# EAGLE design 5channel-LED-Relay (EAGLE 9.0.1)
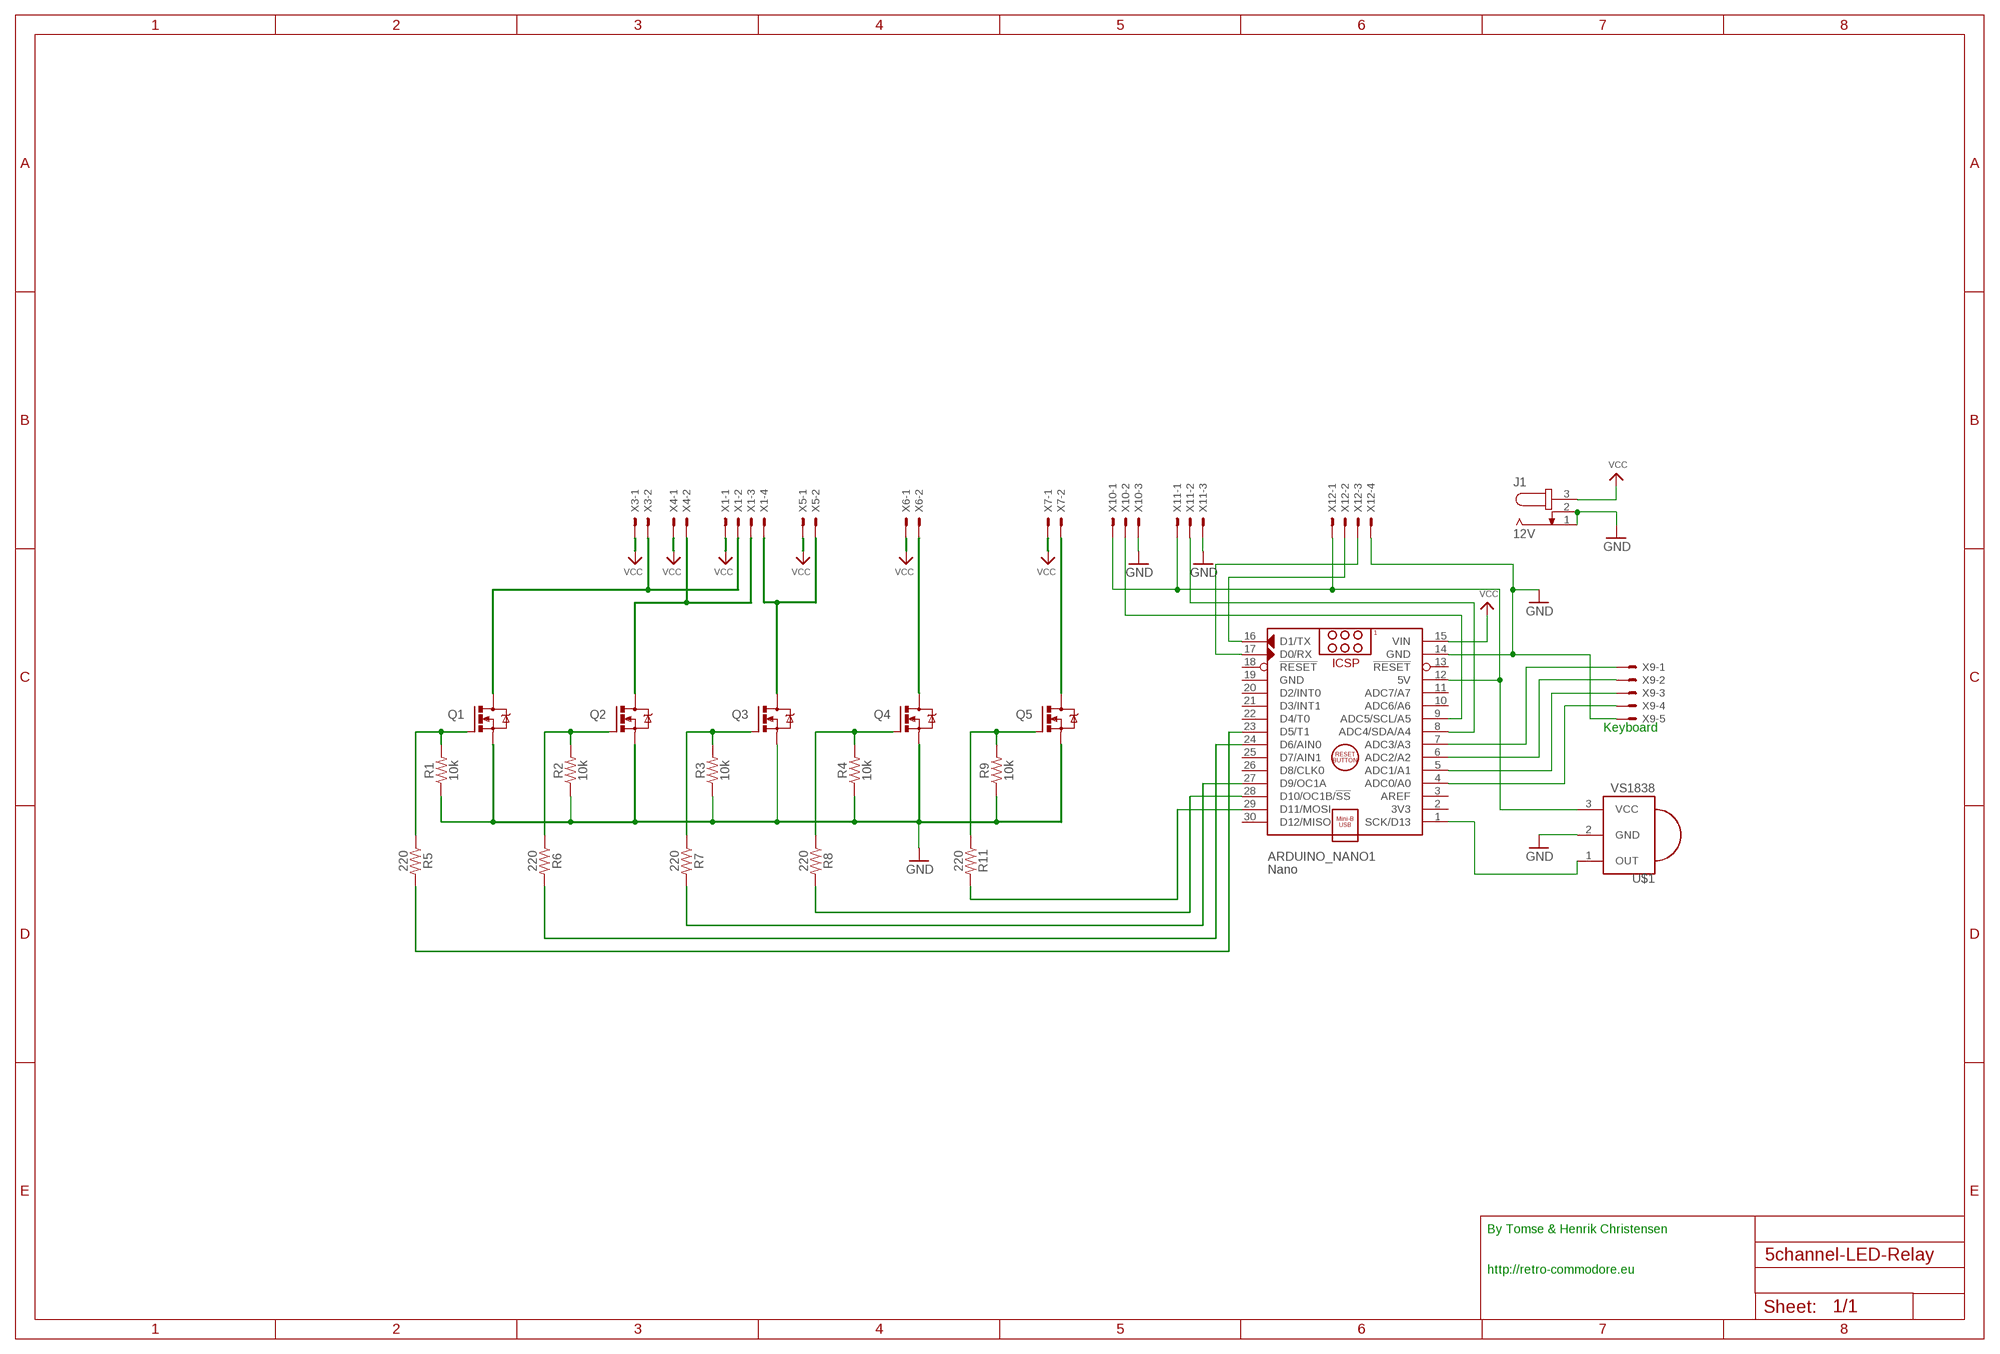
[diagram p0: schematic, sheet 1]

## Parts
ARDUINO_NANO1  Nano  ARDUINO_NANO  [ARDUINO_NANO]
J1  12V  JACK-PLUG0  [SPC4077]
Q1  FQP30N06L  IRF520  [TO220BV]
Q2  FQP30N06L  IRF520  [TO220BV]
Q3  FQP30N06L  IRF520  [TO220BV]
Q4  FQP30N06L  IRF520  [TO220BV]
Q5  FQP30N06L  IRF520  [TO220BV]
R1  10k  10KOHM-HORIZ-1/4W-5%  [AXIAL-0.3]
R2  10k  10KOHM-HORIZ-1/4W-5%  [AXIAL-0.3]
R3  10k  10KOHM-HORIZ-1/4W-5%  [AXIAL-0.3]
R4  10k  10KOHM-HORIZ-1/4W-5%  [AXIAL-0.3]
R5  220  100KOHM-HORIZ-1/4W-5%  [AXIAL-0.3]
R6  220  100KOHM-HORIZ-1/4W-5%  [AXIAL-0.3]
R7  220  100KOHM-HORIZ-1/4W-5%  [AXIAL-0.3]
R8  220  100KOHM-HORIZ-1/4W-5%  [AXIAL-0.3]
R9  10k  10KOHM-HORIZ-1/4W-5%  [AXIAL-0.3]
R11  220  100KOHM-HORIZ-1/4W-5%  [AXIAL-0.3]
U$1  VS1838  PNA460XM  [PNA460XM]
X1  JST-XH-04-PIN-LONG-PAD  [JST-XH-04-PACKAGE-LONG-PAD]
X3  JST-XH-02-PIN-LONG-PAD  [JST-XH-02-PACKAGE-LONG-PAD]
X4  JST-XH-02-PIN-LONG-PAD  [JST-XH-02-PACKAGE-LONG-PAD]
X5  JST-XH-02-PIN-LONG-PAD  [JST-XH-02-PACKAGE-LONG-PAD]
X6  JST-XH-02-PIN-LONG-PAD  [JST-XH-02-PACKAGE-LONG-PAD]
X7  JST-XH-02-PIN-LONG-PAD  [JST-XH-02-PACKAGE-LONG-PAD]
X9  JST-XH-05-PIN-LONG-PAD  [JST-XH-05-PACKAGE-LONG-PAD]
X10  JST-XH-03-PIN-LONG-PAD  [JST-XH-03-PACKAGE-LONG-PAD]
X11  JST-XH-03-PIN-LONG-PAD  [JST-XH-03-PACKAGE-LONG-PAD]
X12  JST-XH-04-PIN-LONG-PAD  [JST-XH-04-PACKAGE-LONG-PAD]

## Nets
5V: ARDUINO_NANO1.12(5V) U$1.3(VCC) X10.1 X11.1 X12.1
C01: Q1.D X1.2 X3.2
C02: Q2.D X1.3 X4.2
C03: Q3.D X1.4 X5.2
C04: Q4.D X6.2
C05: Q5.D X7.2
GND: ARDUINO_NANO1.14(GND) J1.1 J1.2 Q1.S Q2.S Q3.S Q4.S Q5.S R1.P$1 R2.P$1 R3.P$1 R4.P$1 R9.P$1 U$1.2(GND) X9.5 X10.3 X11.3 X12.4
N$1: ARDUINO_NANO1.8(ADC4/SDA/A4) X11.2
N$2: ARDUINO_NANO1.9(ADC5/SCL/A5) X10.2
N$3: ARDUINO_NANO1.29(D11/MOSI) R11.P$2
N$4: ARDUINO_NANO1.1(SCK/D13) U$1.1(OUT)
N$6: Q4.G R4.P$2 R8.P$1
N$7: ARDUINO_NANO1.23(D5/T1) R5.P$2
N$8: ARDUINO_NANO1.24(D6/AIN0) R6.P$2
N$9: ARDUINO_NANO1.27(D9/OC1A) R7.P$2
N$10: ARDUINO_NANO1.28(D10/OC1B/!SS) R8.P$2
N$12: ARDUINO_NANO1.16(D1/TX) X12.2
N$13: Q2.G R2.P$2 R6.P$1
N$14: ARDUINO_NANO1.17(D0/RX) X12.3
N$15: ARDUINO_NANO1.7(ADC3/A3) X9.1
N$16: Q5.G R9.P$2 R11.P$1
N$20: ARDUINO_NANO1.6(ADC2/A2) X9.2
N$21: Q3.G R3.P$2 R7.P$1
N$22: ARDUINO_NANO1.5(ADC1/A1) X9.3
N$23: ARDUINO_NANO1.4(ADC0/A0) X9.4
N$24: Q1.G R1.P$2 R5.P$1
VCC: ARDUINO_NANO1.15(VIN) J1.3 X1.1 X3.1 X4.1 X5.1 X6.1 X7.1
Unconnected: ARDUINO_NANO1.2(3V3) ARDUINO_NANO1.3(AREF) ARDUINO_NANO1.10(ADC6/A6) ARDUINO_NANO1.11(ADC7/A7) ARDUINO_NANO1.13(!RESET) ARDUINO_NANO1.18(!RESET) ARDUINO_NANO1.20(D2/INT0) ARDUINO_NANO1.21(D3/INT1) ARDUINO_NANO1.22(D4/T0) ARDUINO_NANO1.25(D7/AIN1) ARDUINO_NANO1.26(D8/CLK0) ARDUINO_NANO1.30(D12/MISO)

## Notes on the sheet
- Keyboard
- By Tomse & Henrik Christensen
  
  
  http://retro-commodore.eu

## Power pins joined to a net without a drawn wire
GND: ARDUINO_NANO1.19(GND)

## Library data of the parts
ARDUINO_NANO1 = ArduinoNanoV30:ARDUINO_NANO: Arduino Nano V3.0 Module Overview: The Arduino Nano is a small, complete, and breadboard-friendly board based on the ATmega328 (Arduino Nano 3.x) or ATmega168 (Arduino Nano 2.x). It has more or less the same functionality of the Arduino Duemilanove, but in a different package. It lacks only a DC power jack, and works with a Mini-B USB cable instead of a standard one. The Nano was designed and is being produced by Gravitech <http://www.gravitech.us/arna30wiatp.html>. General specifications: Item Value Microcontroller Atmel ATmega168 or ATmega328 Operating Voltage (logic level) 5 V Input Voltage (recommended) 7-12 V Input Voltage (limits) 6-20 V Digital I/O Pins 14 (of which 6 provide PWM output) Analog Input Pins 8 DC Current per I/O Pin 40 mA Flash Memory 16 KB (ATmega168) or 32 KB (ATmega328) of which 2 KB used by bootloader SRAM 1 KB (ATmega168) or 2 KB (ATmega328) EEPROM 512 bytes (ATmega168) or 1 KB (ATmega328) Clock Speed 16 MHz Dimensions (Inches) 0.73" x 1.70" Dimensions (mm) 18mm x 45mm Overall height About 9 mm (not including pins) Weigth 5 g Power: The Arduino Nano can be powered via the Mini-B USB connection, 6-20V unregulated external power supply (pin 30), or 5V regulated external power supply (pin 27). The power source is automatically selected to the highest voltage source. Memory: The ATmega168 has 16 KB of flash memory for storing code (of which 2 KB is used for the bootloader); the ATmega328 has 32 KB, (also with 2 KB used for the bootloader). The ATmega168 has 1 KB of SRAM and 512 bytes of EEPROM (which can be read and written with the EEPROM library); the ATmega328 has 2 KB of SRAM and 1 KB of EEPROM. Input and Output: Each of the 14 digital pins on the Nano can be used as an input or output, using pinMode(), digitalWrite(), and digitalRead() functions. They operate at 5 volts. Each pin can provide or receive a maximum of 40 mA and has an internal pull-up resistor (disconnected by default) of 20-50 kOhms. In addition, some pins have specialized functions. Visit Arduino - ArduinoBoardNano <https://www.arduino.cc/en/Main/ArduinoBoardNano>
J1 = con-jack:JACK-PLUG: DC POWER JACK Power Jack, DC, Right Angle, Through Hole, Rated 5A at 16VDC, PC Terminals Distributor: Farnell (www.Farnell.de) Drawing: 84N1161.pdf / 84N1162.pdf Manufacturer: SPC Technology (www.spctechnology.com) Type: SPC4077 / SPC 4078; OC_FARNELL: unknown; OC_NEWARK: unknown
Q1-Q5 = transistor-power:IRF520: HEXFET Power MOSFET
R1-R4 R9 = SparkFun-Resistors:10KOHM: 10kΩ resistor A resistor is a passive two-terminal electrical component that implements electrical resistance as a circuit element. Resistors act to reduce current flow, and, at the same time, act to lower voltage levels within circuits. - Wikipedia; PROD_ID: RES-09435
R5-R8 R11 = SparkFun-Resistors:100KOHM: 100kΩ resistor A resistor is a passive two-terminal electrical component that implements electrical resistance as a circuit element. Resistors act to reduce current flow, and, at the same time, act to lower voltage levels within circuits. - Wikipedia; PROD_ID: RES-10686; VALUE: 100k
U$1 = adafruit:PNA460XM: IR 38KHz receiver PNA4602 and related receivers http://www.ladyada.net/library/pcb/eaglelibrary.html
X1 X12 = Rembrandt Electronics - JST XH Connectors v1-0:JST-XH-04-PIN: JST XH Connector 2 Pin Wire to board connector. Pitch: 2,54 mm, (0.100") Number of pins: 4 Created by Rembrandt Electronics www.rembrandtelectronics.com
X3-X7 = Rembrandt Electronics - JST XH Connectors v1-0:JST-XH-02-PIN: JST XH Connector 2 Pin Wire to board connector. Pitch: 2,54 mm, (0.100") Number of pins: 2 Created by Rembrandt Electronics www.rembrandtelectronics.com
X9 = Rembrandt Electronics - JST XH Connectors v1-0:JST-XH-05-PIN: JST XH Connector 2 Pin Wire to board connector. Pitch: 2,54 mm, (0.100") Number of pins: 5 Created by Rembrandt Electronics www.rembrandtelectronics.com
X10 X11 = Rembrandt Electronics - JST XH Connectors v1-0:JST-XH-03-PIN: JST XH Connector 2 Pin Wire to board connector. Pitch: 2,54 mm, (0.100") Number of pins: 3 Created by Rembrandt Electronics www.rembrandtelectronics.com

## Board
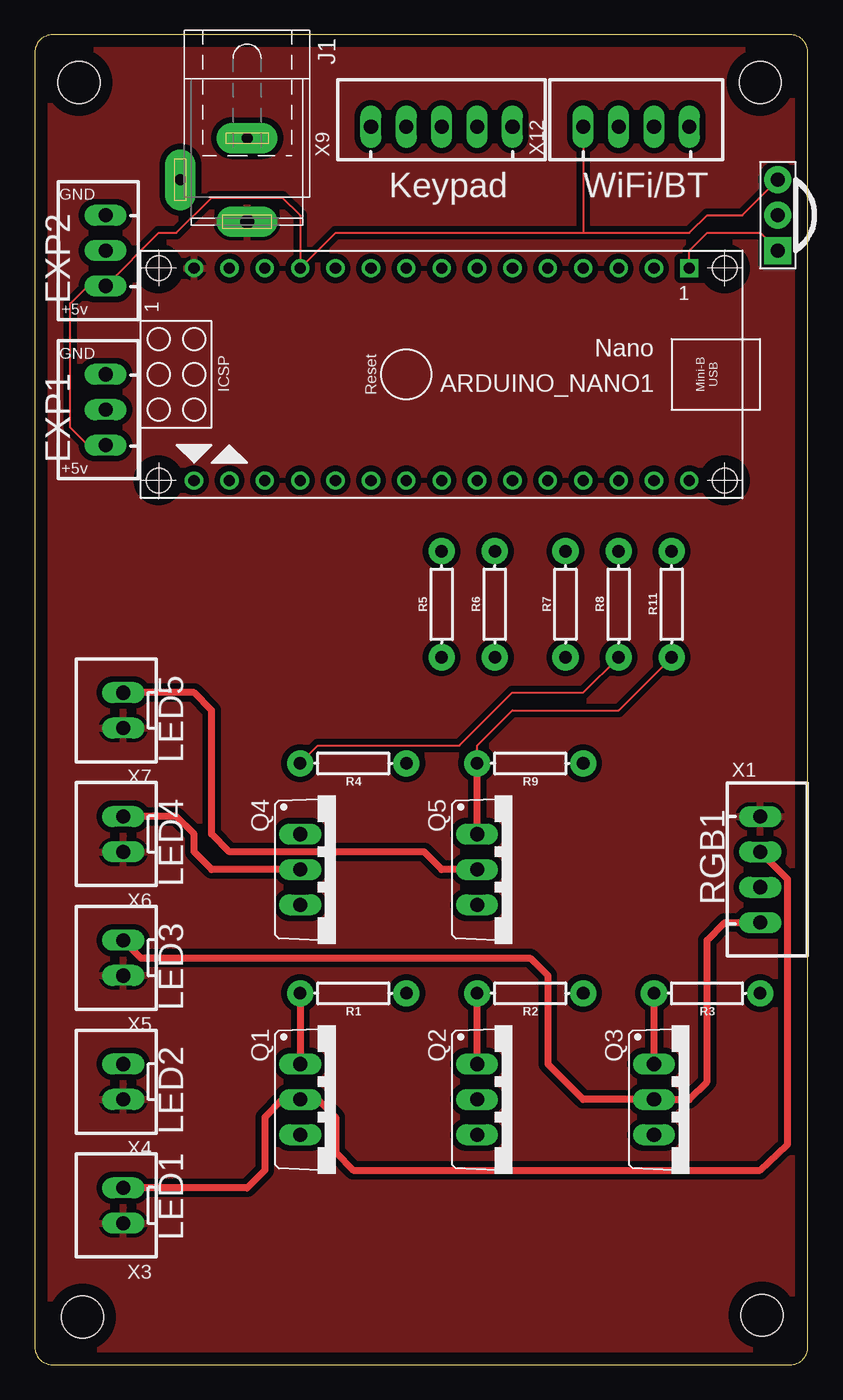
[diagram p1: board, top side]
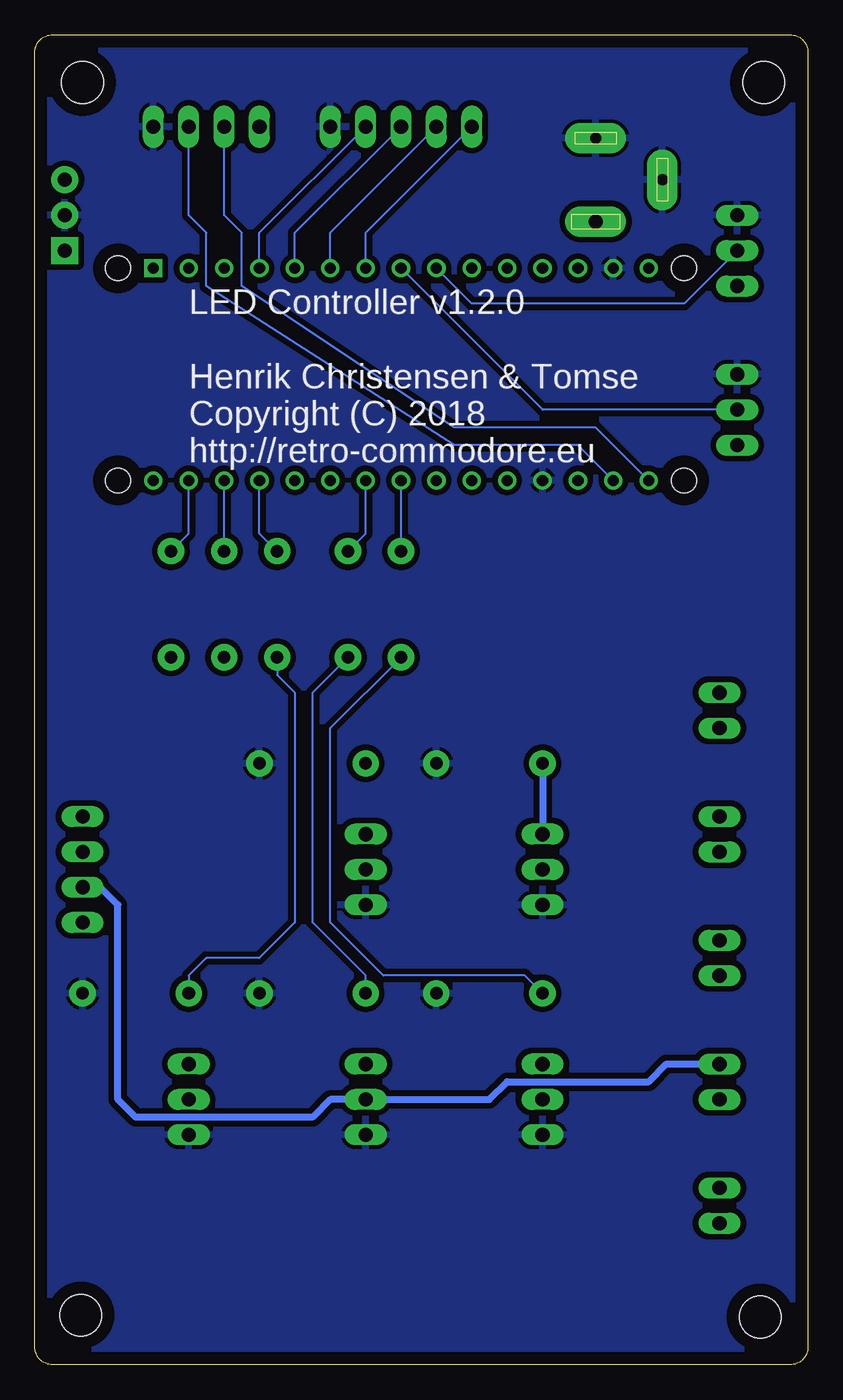
[diagram p2: board, bottom side, seen from below]

Size 55.5 x 95.5 mm. Coordinates in mm from the lower left corner, seen from the top.
Outline: 55.5,1.27 55.5,94.23 arc90 54.23,95.5 1.27,95.5 arc90 0,94.23 0,1.27 arc90 1.27,0 54.23,0 arc90 55.5,1.27
Copper layers (1*16): Top 0.035mm / dielectric 1.5mm / Bottom 0.035mm
Design rules "default *": minimum track width 6mil, minimum drill 0.35mm, track to track 6mil, track to pad 6mil, pad to pad 6mil, via to via 6mil, smd to smd 6mil, copper to edge 35mil, drill to drill 6mil, minimum pad ring 10mil, minimum via ring 8mil, stop-mask expansion 4mil, vias tented up to drill 0mil, thermal gap 10mil
Holes 3 mm at 3.17,92.08 3.43,3.43 52.07,92.08 52.2,3.56

### Footprints (pad centres in the part's own frame; a part is rotated, then mirrored left to right if it is on the bottom)
ARDUINO_NANO = drill 0.8 square: 1 -20.32,-7.62 | drill 0.8: 2 -17.78,-7.62; 3 -15.24,-7.62; 4 -12.7,-7.62; 5 -10.16,-7.62; 6 -7.62,-7.62; 7 -5.08,-7.62; 8 -2.54,-7.62; 9 0,-7.62; 10 2.54,-7.62; 11 5.08,-7.62; 12 7.62,-7.62; 13 10.16,-7.62; 14 12.7,-7.62; 15 15.24,-7.62; 16 15.24,7.62; 17 12.7,7.62; 18 10.16,7.62; 19 7.62,7.62; 20 5.08,7.62; 21 2.54,7.62; 22 0,7.62; 23 -2.54,7.62; 24 -5.08,7.62; 25 -7.62,7.62; 26 -10.16,7.62; 27 -12.7,7.62; 28 -15.24,7.62; 29 -17.78,7.62; 30 -20.32,7.62 | hole 1.778: -22.86,-7.62; -22.86,7.62; 17.78,7.62; 17.78,-7.62
SPC4077 = drill 0.8 pad 2.184 long: 1 -3,0; 2 0,-4.8 | drill 1 pad 2.184 long: 3 3,0
TO220BV = drill 1.016 long: D 0,-2.54; G -2.54,-2.54; S 2.54,-2.54
AXIAL-0.3 = drill 0.9 pad 1.88: P$1 -3.81,0; P$2 3.81,0
PNA460XM = drill 1.016 pad 1.93 square: 1 -2.54,0 | drill 1.016 pad 1.93: 2 0,0; 3 2.54,0
JST-XH-04-PACKAGE-LONG-PAD = drill 1.016 long: 1 -3.81,0; 2 -1.27,0; 3 1.27,0; 4 3.81,0
JST-XH-02-PACKAGE-LONG-PAD = drill 1.016 long: 1 -1.27,0; 2 1.27,0
JST-XH-05-PACKAGE-LONG-PAD = drill 1.016 long: 1 -5.08,0; 2 -2.54,0; 3 0,0; 4 2.54,0; 5 5.08,0
JST-XH-03-PACKAGE-LONG-PAD = drill 1.016 long: 1 -2.54,0; 2 0,0; 3 2.54,0

### Placement (x,y rotation side)
ARDUINO_NANO1  26.67,71.12 180 top
J1  15.24,85.09 270 top
Q1  21.59,19.05 270 top
Q2  34.29,19.05 270 top
Q3  46.99,19.05 270 top
Q4  21.59,35.56 270 top
Q5  34.29,35.56 270 top
R1  22.86,26.67 180 top
R2  35.56,26.67 180 top
R3  48.26,26.67 180 top
R4  22.86,43.18 180 top
R5  29.21,54.61 90 top
R6  33.02,54.61 90 top
R7  38.1,54.61 90 top
R8  41.91,54.61 90 top
R9  35.56,43.18 180 top
R11  45.72,54.61 90 top
U$1  53.34,82.55 90 top
X1  52.07,35.56 270 top
X3  6.35,11.43 90 top
X4  6.35,20.32 90 top
X5  6.35,29.21 90 top
X6  6.35,38.1 90 top
X7  6.35,46.99 90 top
X9  29.21,88.9 0 top
X10  5.08,80.01 90 top
X11  5.08,68.58 90 top
X12  43.18,88.9 0 top

### Tracks (layer width: path | path; a pad name or v marks a point on that pad's centre or on a via)
5V
  Top 0.152: X11.1 3.81,66.04 2.54,67.31 2.54,76.2 3.81,77.47 X10.1 8.89,81.28 10.16,81.28 12.7,83.82 17.78,83.82 19.05,82.55 ARDUINO_NANO1.12 21.59,81.28 39.37,81.28 | 39.37,81.28 46.99,81.28 48.26,82.55 50.8,82.55 U$1.3 | X12.1 39.37,81.28
C01
  Top 0.152: 54.03,34.87 54.03,34.8
  Top 0.508: 54.03,34.8 54.03,15.8 52.07,13.97 22.86,13.97 21.59,15.24 21.59,17.78 20.32,19.05 Q1.D 17.78,19.05 16.51,17.78 16.51,13.97 15.24,12.7 X3.2 | X1.2 54.03,34.87
C02
  Bottom 0.508: X1.3 50.8,34.29 49.53,33.02 49.53,19.05 48.26,17.78 35.56,17.78 34.29,19.05 Q2.D 22.86,19.05 21.59,20.32 11.43,20.32 10.16,21.59 X4.2
C03
  Top 0.508: X5.2 7.62,29.21 35.56,29.21 36.83,27.94 36.83,21.59 39.37,19.05 Q3.D 46.99,19.05 48.26,20.32 48.26,30.48 49.53,31.75 X1.4
C04
  Top 0.508: Q4.D 12.7,35.56 11.43,36.83 11.43,38.1 10.16,39.37 X6.2
C05
  Top 0.508: Q5.D 29.21,35.56 27.94,36.83 13.97,36.83 12.7,38.1 12.7,46.99 11.43,48.26 X7.2
GND
  pour Bottom (isolate 0.406): -8.89,99.06 60.96,99.06 62.23,97.79 63.5,96.52 63.5,-8.89 -10.16,-8.89 -12.7,-6.35 -12.7,95.25
N$1
  Bottom 0.152: X11.2 19.05,68.58 ARDUINO_NANO1.8
N$2
  Bottom 0.152: X10.2 8.89,76.2 24.13,76.2 ARDUINO_NANO1.9
N$3
  Bottom 0.152: R11.P$2 44.45,59.69 ARDUINO_NANO1.29
N$4
  Top 0.152: ARDUINO_NANO1.1 46.99,80.01 48.26,81.28 52.07,81.28 U$1.1
N$6
  Top 0.152: R8.P$1 39.37,48.26 34.29,48.26 30.48,44.45 20.32,44.45 R4.P$2
  Bottom 0.508: R4.P$2 Q4.G
N$7
  Bottom 0.152: R5.P$2 ARDUINO_NANO1.23
N$8
  Bottom 0.152: R6.P$2 31.75,59.69 ARDUINO_NANO1.24
N$9
  Bottom 0.152: R7.P$2 39.37,59.69 ARDUINO_NANO1.27
N$10
  Bottom 0.152: R8.P$2 ARDUINO_NANO1.28
N$12
  Bottom 0.152: ARDUINO_NANO1.16 15.24,67.31 25.4,67.31 40.64,77.47 40.64,81.28 41.91,82.55 X12.2 41.91,87.63
N$13
  Top 0.508: Q2.G R2.P$2
  Bottom 0.152: R6.P$1 35.56,48.26 35.56,31.75 31.75,27.94 R2.P$2
N$14
  Bottom 0.152: ARDUINO_NANO1.17 16.51,66.04 25.4,66.04 43.18,77.47 43.18,81.28 44.45,82.55 X12.3
N$15
  Bottom 0.152: ARDUINO_NANO1.7 31.75,81.28 X9.1
N$16
  Top 0.152: R9.P$2 31.75,44.45 34.29,46.99 41.91,46.99 R11.P$1
  Top 0.508: Q5.G R9.P$2
N$20
  Bottom 0.152: ARDUINO_NANO1.6 34.29,81.28 X9.2
N$21
  Top 0.508: Q3.G R3.P$2
  Bottom 0.152: R7.P$1 38.1,49.53 36.83,48.26 36.83,31.75 39.37,29.21 43.18,29.21 44.45,27.94 R3.P$2
N$22
  Bottom 0.152: ARDUINO_NANO1.5 36.83,81.28 X9.3
N$23
  Bottom 0.152: ARDUINO_NANO1.4 39.37,81.28 X9.4
N$24
  Top 0.508: R1.P$2 Q1.G
  Bottom 0.152: R1.P$2 20.32,27.94 30.48,27.94 34.29,31.75 34.29,45.72 R5.P$1
VCC
  pour Top (isolate 0.406): -3.81,97.79 59.69,97.79 60.96,96.52 60.96,-6.35 -3.81,-6.35 -6.35,-3.81 -6.35,95.25

### Text on the board
tPlace: GND | Keypad | WiFi/BT | EXP2 | +5v | GND | EXP1 | +5v | LED5 | LED4 | RGB1 | LED3 | LED2 | LED1
bPlace: LED Controller v1.2.0 / / Henrik Christensen & Tomse / Copyright (C) 2018 / http://retro-commodore.eu